# EAGLE design atsamdg21_v1.20 (EAGLE 9.5.1)
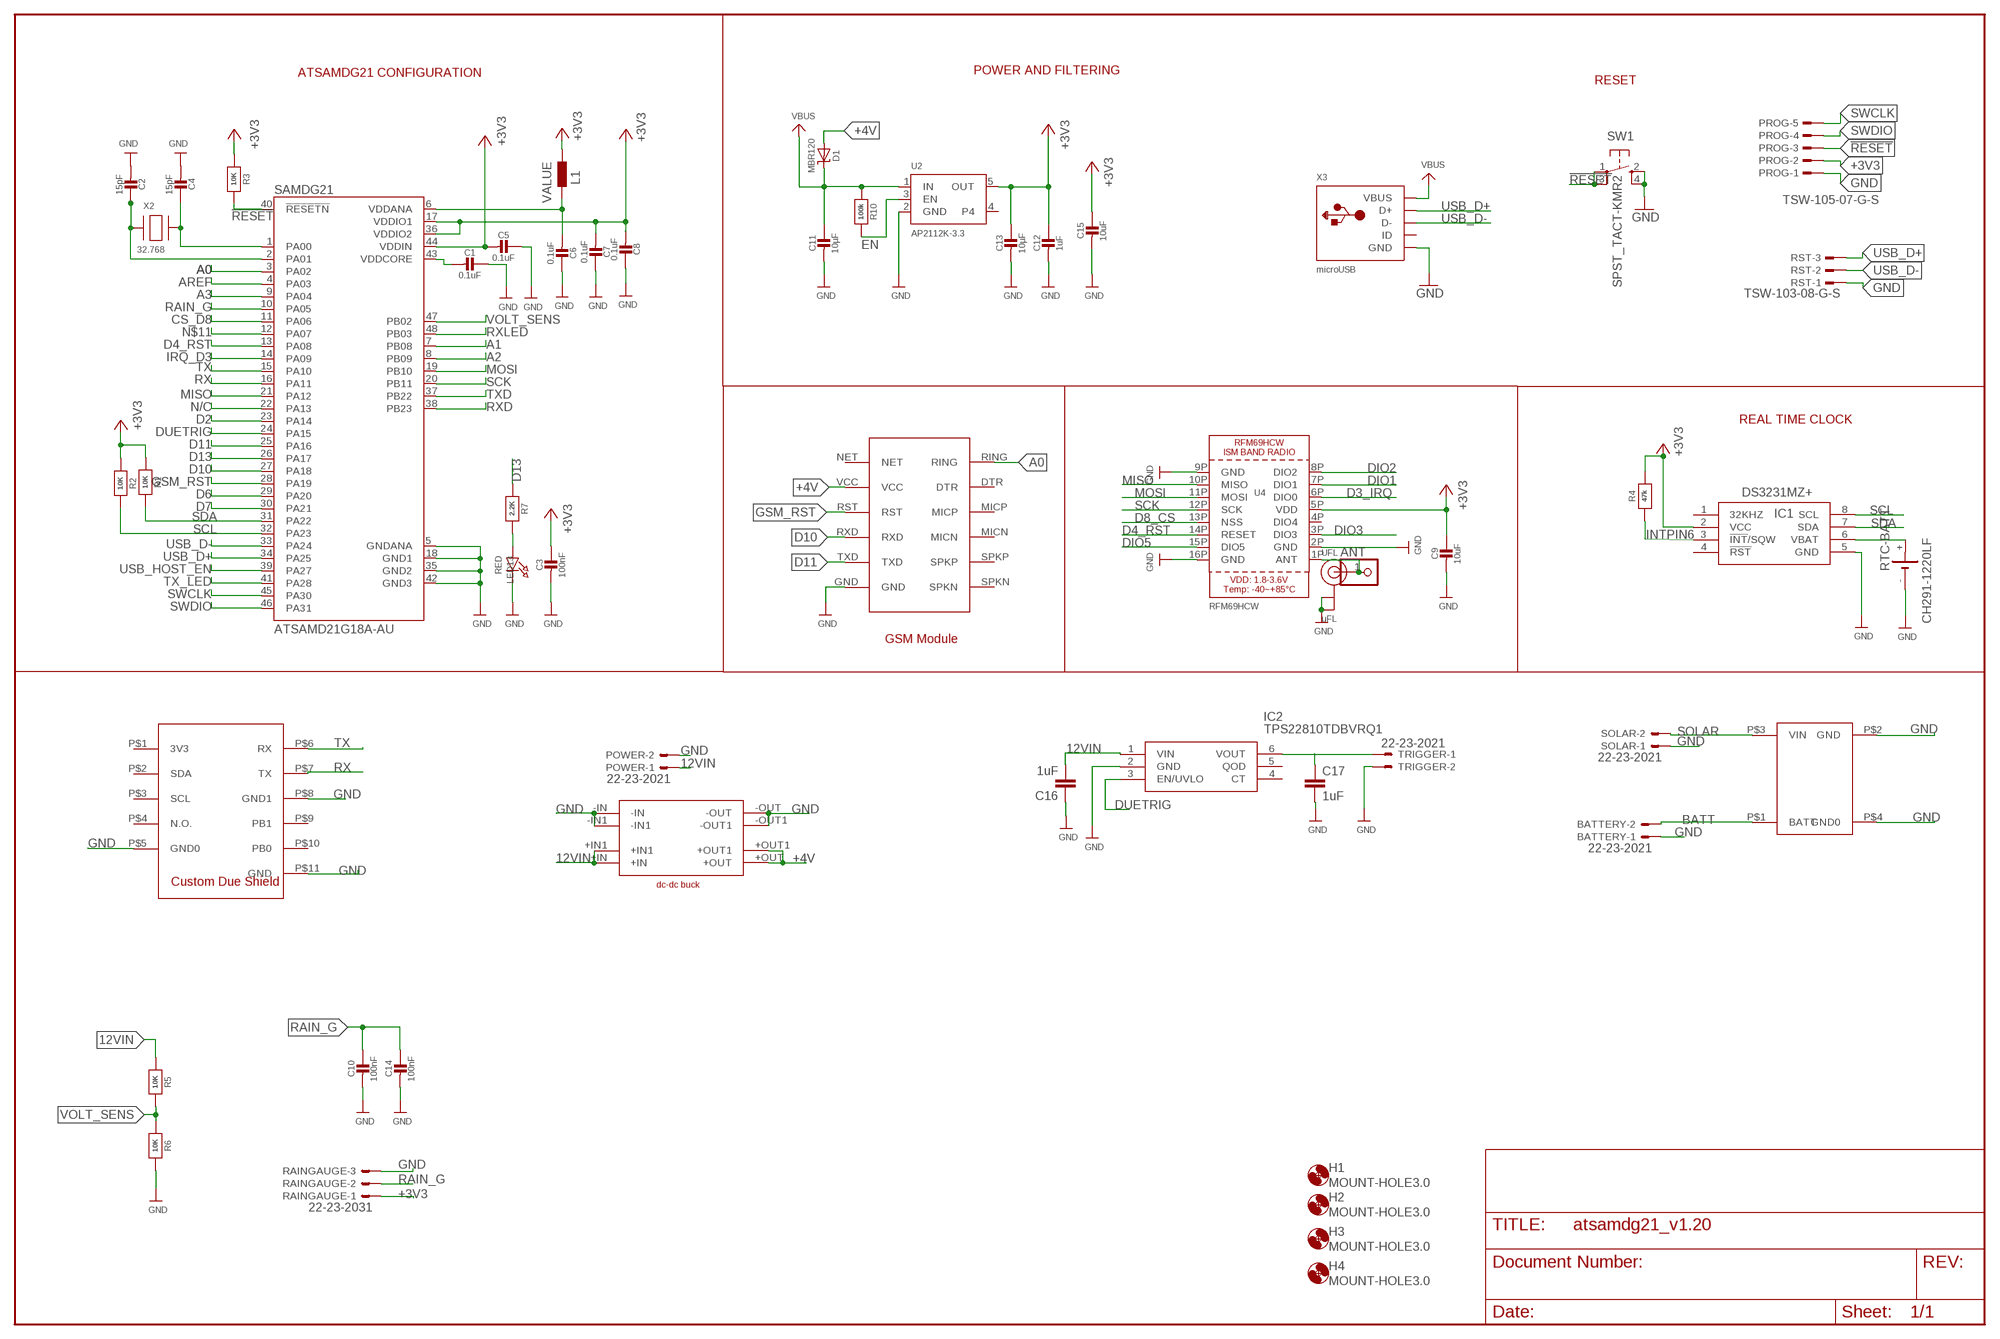
[diagram p0: schematic, sheet 1]

## Parts
ANT  HEADER-1X1ROUND  [1X01_ROUND]
BATTERY  22-23-2021  [22-23-2021]
C1  0.1uF  CAP_CERAMIC0603_NO  [0603-NO]
C2  15pF  CAP_CERAMIC0603_NO  [0603-NO]
C3  100nF  CAP_CERAMIC0603_NO  [0603-NO]
C4  15pF  CAP_CERAMIC0603_NO  [0603-NO]
C5  0.1uF  CAP_CERAMIC0603_NO  [0603-NO]
C6  0.1uF  CAP_CERAMIC0603_NO  [0603-NO]
C7  0.1uF  CAP_CERAMIC0603_NO  [0603-NO]
C8  0.1uF  CAP_CERAMIC0603_NO  [0603-NO]
C9  10uF  CAP_CERAMIC0805-NOOUTLINE  [0805-NO]
C10  100nF  CAP_CERAMIC0603_NO  [0603-NO]
C11  10µF  CAP_CERAMIC0805-NOOUTLINE  [0805-NO]
C12  1uF  CAP_CERAMIC0603_NO  [0603-NO]
C13  10µF  CAP_CERAMIC0805-NOOUTLINE  [0805-NO]
C14  100nF  CAP_CERAMIC0603_NO  [0603-NO]
C15  10uF  CAP_CERAMIC0805-NOOUTLINE  [0805-NO]
C16  1uF  CC0603  [C0603]
C17  1uF  CC0603  [C0603]
D1  MBR120  DIODE-SCHOTTKYSOD-123  [SOD-123]
H1  MOUNT-HOLE3.0  [3,0]
H2  MOUNT-HOLE3.0  [3,0]
H3  MOUNT-HOLE3.0  [3,0]
H4  MOUNT-HOLE3.0  [3,0]
IC1  DS3231MZ+  [SOIC127P600X175-8N]
IC2  TPS22810TDBVRQ1  [SOT95P280X145-6N]
L1  BLM15HB121SN1  [0402]
LED13  RED  LED0805_NOOUTLINE  [CHIPLED_0805_NOOUTLINE]
POWER  22-23-2021  [22-23-2021]
PROG  TSW-105-07-G-S  [TSW-105-XX-G-S]
R1  10K  RESISTOR_0603_NOOUT  [0603-NO]
R2  10K  RESISTOR_0603_NOOUT  [0603-NO]
R3  10K  RESISTOR_0603_NOOUT  [0603-NO]
R4  47k  RESISTOR_0603_NOOUT  [0603-NO]
R5  10K  RESISTOR_0603_NOOUT  [0603-NO]
R6  10K  RESISTOR_0603_NOOUT  [0603-NO]
R7  2.2K  RESISTOR_0603_NOOUT  [0603-NO]
R10  100k  RESISTOR_0603_NOOUT  [0603-NO]
RAINGAUGE  22-23-2031  [22-23-2031]
RST  TSW-103-08-G-S  [TSW-103-XX-G-S]
RTC-BATT  CH291-1220LF  [CH291-1220LF]
SAMDG21  ATSAMD21G18A-AU  [QFP50P900X900X120-48N]
SOLAR  22-23-2021  [22-23-2021]
SW1  SPST_TACT-KMR2  [KMR2]
TRIGGER  22-23-2021  [22-23-2021]
U2  AP2112K-3.3  VREG_SOT23-5  [SOT23-5]
U4  RFM69HCW  RFM69HCW_SMT  [RFMHCW_SMT]
U$7  SIM800L_MODULE  [SIM800L]
U$19  DC-DC_BUCK_MAD  [DC-DC_BUCK]
U$20  DUE_PADSDUE_GSM  [DUESHIELD_BIG]
U$36  LI-ION-CHARGER  [LI-ION]
UFL  uFL  ANTENNA_U.FL  [U.FL]
X2  32.768  XTAL-3.2X1.5  [XTAL3215]
X3  microUSB  USB_MICRO_20329_V2  [4UCONN_20329_V2]

## Nets
12VIN: C16.2 IC2.1(VIN) POWER.1 R5.1 U$19.+IN U$19.+IN1
!RESET: PROG.3 R3.2 SAMDG21.40(!RESETN) SW1.1(P) SW1.3(P1)
+3V3: C3.1 C5.2 C7.2 C8.2 C9.1 C12.1 C13.1 C15.1 IC1.2(VCC) L1.1 PROG.2 R1.1 R2.1 R3.1 R4.2 RAINGAUGE.1 SAMDG21.17(VDDIO1) SAMDG21.36(VDDIO2) SAMDG21.44(VDDIN) U2.5(OUT) U4.5P(VDD)
+4V: D1.A U$7.VCC U$19.+OUT U$19.+OUT1
A0: SAMDG21.3(PA02) U$7.RING
A1: SAMDG21.7(PB08)
A2: SAMDG21.8(PB09)
A3: SAMDG21.9(PA04)
ANT: ANT.1 U4.1P(ANT) UFL.3(SIGNAL)
AREF: SAMDG21.4(PA03)
BATT: BATTERY.2 U$36.P$1(BATT)
CS_D8: SAMDG21.11(PA06)
D2: SAMDG21.23(PA14)
D3_IRQ: U4.6P(DIO0)
D4_RST: SAMDG21.13(PA08) U4.14P(RESET)
D6: SAMDG21.29(PA20)
D7: SAMDG21.30(PA21)
D8_CS: U4.13P(NSS)
D10: SAMDG21.27(PA18) U$7.RXD
D11: SAMDG21.25(PA16) U$7.TXD
D13: R7.1 SAMDG21.26(PA17)
DIO1: U4.7P(DIO1)
DIO2: U4.8P(DIO2)
DIO3: U4.3P(DIO3)
DIO5: U4.15P(DIO5)
DUETRIG: IC2.3(EN/UVLO) SAMDG21.24(PA15)
EN: R10.2 U2.3(EN)
GND: BATTERY.1 C1.1 C2.2 C3.2 C4.2 C5.1 C6.1 C7.1 C8.1 C9.2 C10.2 C11.2 C12.2 C13.2 C14.2 C15.2 C16.1 C17.2 IC1.5(GND) IC2.2(GND) LED13.C POWER.2 PROG.1 R6.2 RAINGAUGE.3 RST.1 RTC-BATT.- SAMDG21.5(GNDANA) SAMDG21.18(GND1) SAMDG21.35(GND2) SAMDG21.42(GND3) SOLAR.1 SW1.2(S) SW1.4(S1) TRIGGER.2 U2.2(GND) U4.2P(GND) U4.9P(GND) U4.16P(GND) U$7.GND U$19.-IN U$19.-IN1 U$19.-OUT U$19.-OUT1 U$20.P$5(GND0) U$20.P$8(GND1) U$20.P$11(GND) U$36.P$2(GND) U$36.P$4(GND0) UFL.1(GND) UFL.2(GND) X3.BASE@1(GND) X3.BASE@2(GND) X3.GND X3.SPRT@1(GND) X3.SPRT@2(GND) X3.SPRT@3(GND) X3.SPRT@4(GND)
GSM_RST: SAMDG21.28(PA19) U$7.RST
INTPIN6: IC1.3(!INT!/SQW) R4.1
IRQ_D3: SAMDG21.14(PA09)
MISO: SAMDG21.21(PA12) U4.10P(MISO)
MOSI: SAMDG21.19(PB10) U4.11P(MOSI)
N$1: C1.2 SAMDG21.43(VDDCORE)
N$2: IC1.6(VBAT) RTC-BATT.+
N$4: C6.2 L1.2 SAMDG21.6(VDDANA)
N$5: C2.1 SAMDG21.2(PA01) X2.P$1
N$6: C17.1 IC2.6(VOUT) TRIGGER.1
N$7: C4.1 SAMDG21.1(PA00) X2.P$2
N$11: SAMDG21.12(PA07)
N$40: LED13.A R7.2
N/C: SAMDG21.22(PA13)
RAIN_G: C10.1 C14.1 RAINGAUGE.2 SAMDG21.10(PA05)
RX: SAMDG21.16(PA11) U$20.P$7(TX)
RXD: SAMDG21.38(PB23)
RXLED: SAMDG21.48(PB03)
SCK: SAMDG21.20(PB11) U4.12P(SCK)
SCL: IC1.8(SCL) R2.2 SAMDG21.32(PA23)
SDA: IC1.7(SDA) R1.2 SAMDG21.31(PA22)
SOLAR: SOLAR.2 U$36.P$3(VIN)
SWCLK: PROG.5 SAMDG21.45(PA30)
SWDIO: PROG.4 SAMDG21.46(PA31)
TX: SAMDG21.15(PA10) U$20.P$6(RX)
TX_LED: SAMDG21.41(PA28)
TXD: SAMDG21.37(PB22)
USB_D+: RST.3 SAMDG21.34(PA25) X3.D+
USB_D-: RST.2 SAMDG21.33(PA24) X3.D-
USB_HOST_EN: SAMDG21.39(PA27)
VBUS: C11.1 D1.C R10.1 U2.1(IN) X3.VBUS
VOLT_SENS: R5.2 R6.1 SAMDG21.47(PB02)
Unconnected: IC1.1(32KHZ) IC1.4(!RST) IC2.4(CT) IC2.5(QOD) U2.4 U4.4P(DIO4) U$7.DTR U$7.MICN U$7.MICP U$7.NET U$7.SPKN U$7.SPKP U$20.P$1(3V3) U$20.P$2(SDA) U$20.P$3(SCL) U$20.P$4(N.O.) U$20.P$9(PB1) U$20.P$10(PB0) X3.ID

## Notes on the sheet
- ATSAMDG21 CONFIGURATION | POWER AND FILTERING
- RESET
- REAL TIME CLOCK
- GSM Module

## Library data of the parts
ANT = microbuilder:HEADER-1X1: PIN HEADER
BATTERY POWER SOLAR TRIGGER = con-molex:22-23-2021: .100" (2.54mm) Center Header - 2 Pin; MF: MOLEX; MPN: 22-23-2021; OC_FARNELL: 1462926; OC_NEWARK: 25C3832
C1-C15 = microbuilder:CAP_CERAMIC: Ceramic Capacitors For new designs, use the packages preceded by an '_' character since they are more reliable: The following footprints should be used on most boards: _0402 - Standard footprint for regular board layouts _0603 - Standard footprint for regular board layouts _0805 - Standard footprint for regular board layouts _1206 - Standard footprint for regular board layouts For extremely tight-pitch boards where space is at a premium, the following 'micro-pitch' footprints can be used (smaller pads, no silkscreen outline, etc.): _0402MP - Micro-pitch footprint for very dense/compact boards _0603MP - Micro-pitch footprint for very dense/compact boards _0805MP - Micro-pitch footprint for very dense/compact boards _1206MP - Micro-pitch footprint for very dense/compact boards
C16 C17 = eagle-ltspice:C: CAPACITOR, European symbol; SPICEMODEL: NONE; SPICEPREFIX: C
D1 = microbuilder:DIODE-SCHOTTKY
H1-H4 = holes:MOUNT-HOLE: MOUNTING HOLE with drill center marker
IC1 = DS3231MZ+:DS3231MZ+: Real Time Clock 5+/-ppm RTC Source: Datasheet <http://uk.rs-online.com/web/p/products/1897249>; DESCRIPTION: Real Time Clock 5+/-ppm RTC; HEIGHT: 1.75mm; MANUFACTURER_NAME: Maxim Integrated; MANUFACTURER_PART_NUMBER: DS3231MZ+; RS_PART_NUMBER: 1897249; RS_PRICE-STOCK: http://uk.rs-online.com/web/p/products/1897249
IC2 = TPS22810TDBVRQ1:TPS22810TDBVRQ1: Automotive 18V, 2A, 79m Load Switch With Adjustable Rise Time and Adjustable Quick Output Discharge Source: Datasheet <http://www.ti.com/lit/gpn/tps22810-q1>; DESCRIPTION: Automotive 18V, 2A, 79m Load Switch With Adjustable Rise Time and Adjustable Quick Output Discharge; HEIGHT: 1.45mm; MANUFACTURER_NAME: Texas Instruments; MANUFACTURER_PART_NUMBER: TPS22810TDBVRQ1
L1 = inductors:BLM15H: EMIFIL (R) Chip Ferrite Bead for GHz Noise Source: http://www.murata.com/ Ferrite Bead BLM15H.pdf
LED13 = microbuilder:LED: LED 0603 - 0603 Surface Mount Package 2mA: Green LED - Low Power (3.9mcd, 2ma, 1.7Vf) - Digikey: 475-2709-2-ND Orange LED - Low Power (9.8mcd, 2ma, 1.8Vf) - Digikey: 475-1194-2-ND Red LED - Low Power (5mcd, 2ma, 1.8Vf) - Digikey: 475-1195-2-ND Yellow LED - Low Power (7mcd, 2ma, 1.8Vf) - Digikey: 475-1196-2-ND 5mA: Blue LED - Low Power (17mcd, 5ma, 2.9Vf) - Digikey: LNJ937W8CRACT-ND 0805 - 0805 Surface Mount Package 2mA: Red LED (8.8mcd, 2mA, 1.8Vf, Clear) - Low Power [Digikey: 475-2510-1-ND] Green LED (5mcd, 2mA, 1.8Vf, Clear) - Low Power [Digikey: 475-2730-1-ND] Yellow LED (11.3mcd, 2mA, 1.8Vf, Clear) - Low Power [Digikey: 475-2555-1-ND] 20mA: Red LED (104mcd, 20mA, Diffused) - LS R976 [Digikey: 475-1278-6-ND] Red LED (12mcd, 20mA, 2.0Vf, Clear) - APT2012EC [Digikey: 754-1128-1-ND] Green LED (15mcd, 20mA, 2.2Vf, Clear) - APT2012GC [Digikey: 754-1131-1-ND] Orange LED (160mcd, 20mA, 2.1Vf, Clear) - APT2012SECK [Digikey: 754-1130-1-ND] 1206 - 1206 Surface Mount Package Green LED (26mcd, 20mA, Diffused) - LG N971 [Digikey: 475-1407-6-ND] Red LED (15mcd, 20mA, Diffused) - LH N974 [Digikey: 475-1416-6-ND] Cree - Cree High-Power Surface Mount LEDs XPEBWT-L1-0000-00D50 - White 111lm 350mA 2.9Vf 6200K 110° XTEAWT-00-0000-00000LEE3 - White 114lm 350mA 2.85Vf 5000K 115° Everlight - Everlight 45-21 Series Surface Mount LEDs 45-21/QK2C-B2832AC2CB2/2T - Warm White 2000mcd 20mA 3.25Vf 3050K 120° 45-21/LK2C-B38452C4CB2/2T - Nuetral White 2000mcd 20mA 3.25Vf 4150K 120° 45-21/LK2C-B50634C6CB2/2T - Cold White 2200mcd 20mA 3.25Vf 5650K 120° PLCC2 Reverse Mount LS T77K-J1L2-1-0-2-R18-Z - Red 11.25mcd 2mA 1.8Vf 630nm 120° LO T77K-L1M2-24-Z - Orange 19.6mcd 2mA 1.8Vf 606nm 120° LY T77K-K2M1-26-Z - Yellow 15.7mcd 2mA 1.8Vf 587nm 120°
PROG = con-samtec:TSW-105-*-G-S: THROUGH-HOLE .025" SQ POST HEADER Source: Samtec TSW.pdf; MF: Samtec Inc.; MPN: TSW-105-07-G-S
R1-R7 R10 = microbuilder:RESISTOR: Resistors For new designs, use the packages preceded by an '_' character since they are more reliable: The following footprints should be used on most boards: _0402 - Standard footprint for regular board layouts _0603 - Standard footprint for regular board layouts _0805 - Standard footprint for regular board layouts _1206 - Standard footprint for regular board layouts For extremely tight-pitch boards where space is at a premium, the following 'micro-pitch' footprints can be used (smaller pads, no silkscreen outline, etc.): _0402MP - Micro-pitch footprint for very dense/compact boards _0603MP - Micro-pitch footprint for very dense/compact boards _0805MP - Micro-pitch footprint for very dense/compact boards _1206MP - Micro-pitch footprint for very dense/compact boards
RAINGAUGE = con-molex:22-23-2031: .100" (2.54mm) Center Header - 3 Pin; MF: MOLEX; MPN: 22-23-2031; OC_FARNELL: 1462950; OC_NEWARK: 30C0862
RST = con-samtec:TSW-103-*-G-S: THROUGH-HOLE .025" SQ POST HEADER Source: Samtec TSW.pdf; MF: Samtec Inc.; MPN: TSW-103-07-G-S
RTC-BATT = battery:CH291-1220LF: Battery Holder, SMT, 12mm multicomp PART NO. CH291-1220LF Source: Data sheet <http://www.farnell.com/datasheets/1505860.pdf>
SAMDG21 = ATSAMD21G18A-AU:ATSAMD21G18A-AU: Cortex-M0+, 256KB FLASH, 32KB SRAM, USB, DMA, T&R - 48TQFP IND TEMP, GREEN, 1.6-3.6V, 48MHz; AVAILABILITY: Unavailable; DESCRIPTION: SAMD21G Series 256 kB Flash 32 kB SRAM 48 MHz 32-Bit Microcontroller - TQFP-48; MF: Microchip; MP: ATSAMD21G18A-AU; PACKAGE: TQFP-48 Microchip; PRICE: None
SW1 = adafruit:SPST_TACT: SMT 6mm switch, EVQQ2 series http://www.ladyada.net/library/eagle
U2 = microbuilder:VREG_SOT23-5: SOT23-5 Fixed Voltage Regulators Part Current Out V Out V In V Dropout θJA (°C/W) TJ (°C) Digikey Part No. ADP121 150mA 3.3V 3.4-5.5V 0.09V @ 150mA -- -- ADP121-AUJZ33R7CT-ND ADP121 150mA 3.0V 3.1-5.5V 0.09V @ 150mA -- -- ADP121-AUJZ30R7CT-ND ADP122 300mA 3.3V 3.4-5.5V 0.085V @ 300mA -- -- ADP122AUJZ-3.3-R7CT-ND ADP1712 300mA 3.3V 3.5-5.5V 0.17V @ 300mA -- -- ADP1712AUJZ-3.3-R7TR-ND AP7311 (Low Cost) 150mA 3.3V 3.5-6V 0.15V @ 150mA -- -- AP7311-33WG-7DICT-ND LD39015M18R 150mA 1.8V 1.9V-5.5V 0.08V @ 100mA -- -- 497-6977-1-ND LP2985A-33DBVR 150mA 3.3V 3.3-16V 0.28V @ 150mA 206 150 296-18479-1-ND MCP1824T-3302E/OT 300mA 3.3V 3.5V-6V 0.2V @ 300mA -- -- MCP1824T-3302E/OTCT-ND MIC5205-2.5YM5 TR 150mA 2.5V 2.7-16V 0.165V @ 150mA -- -- 576-1257-2-ND MIC5205-3.0YM5 TR 150mA 3.0V 3.2V-16V 0.165V @ 150mA -- -- 576-1258-2-ND MIC5205-3.3YM5 TR 150mA 3.3V 3.5V-16V 0.165V @ 150mA -- -- 576-1259-2-ND TPS780330220 150mA 3.3V+2.2V 3.6-5.5V 250mV Max -- -- 296-23332-1-ND TDA3663/N1,135 100mA 3.3V 3.5-45V 0.18V @ 50mA -- -- 568-5343-1-ND Max operating temp can be calculated using θJA, TJ (max junction temperature), and power in watts. Set the "Maximum Ambient Temperature" until it reaches TJ ("Max Junction Temperature"), which is the absolute limit for safe use of the regulator: Heat Sink Temperature Calculator <http://www.daycounter.com/Calculators/Heat-Sink-Temperature-Calculator.phtml> For example, With 12V source into a 3.3V LP2985 and a 30mA load, we are dissipating (12V-3.3V) * 0.03A = 0.261W. With a θJA of 206 °C/W, a TJ of 150°C, and 261mW we can safely use the chip without a heat sink up to 75°C (=147.1°C Junction Temperature).
U4 = microbuilder:RFM69HCW: RFM69HCW - ISM Band RF Transceiver
U$7 = sim800L_module:SIM800L_MODULE
U$19 = dc-dc_mad:DC-DC_BUCK_MAD
U$20 = due_shield_pad:DUE_PADS
U$36 = LI-ION-CHARGER:LI-ION-CHARGER
UFL = microbuilder:ANTENNA_U.FL: U.FL Antenna Connector
X2 = adafruit2:XTAL: Low cost SMT crystals, no capacitors included http://www.ladyada.net/library/eagle
X3 = microbuilder:USB: USB Connectors USBMINIB - Surface Mount Female Mini-B USB Connector 4UConnector: 06564

## Board
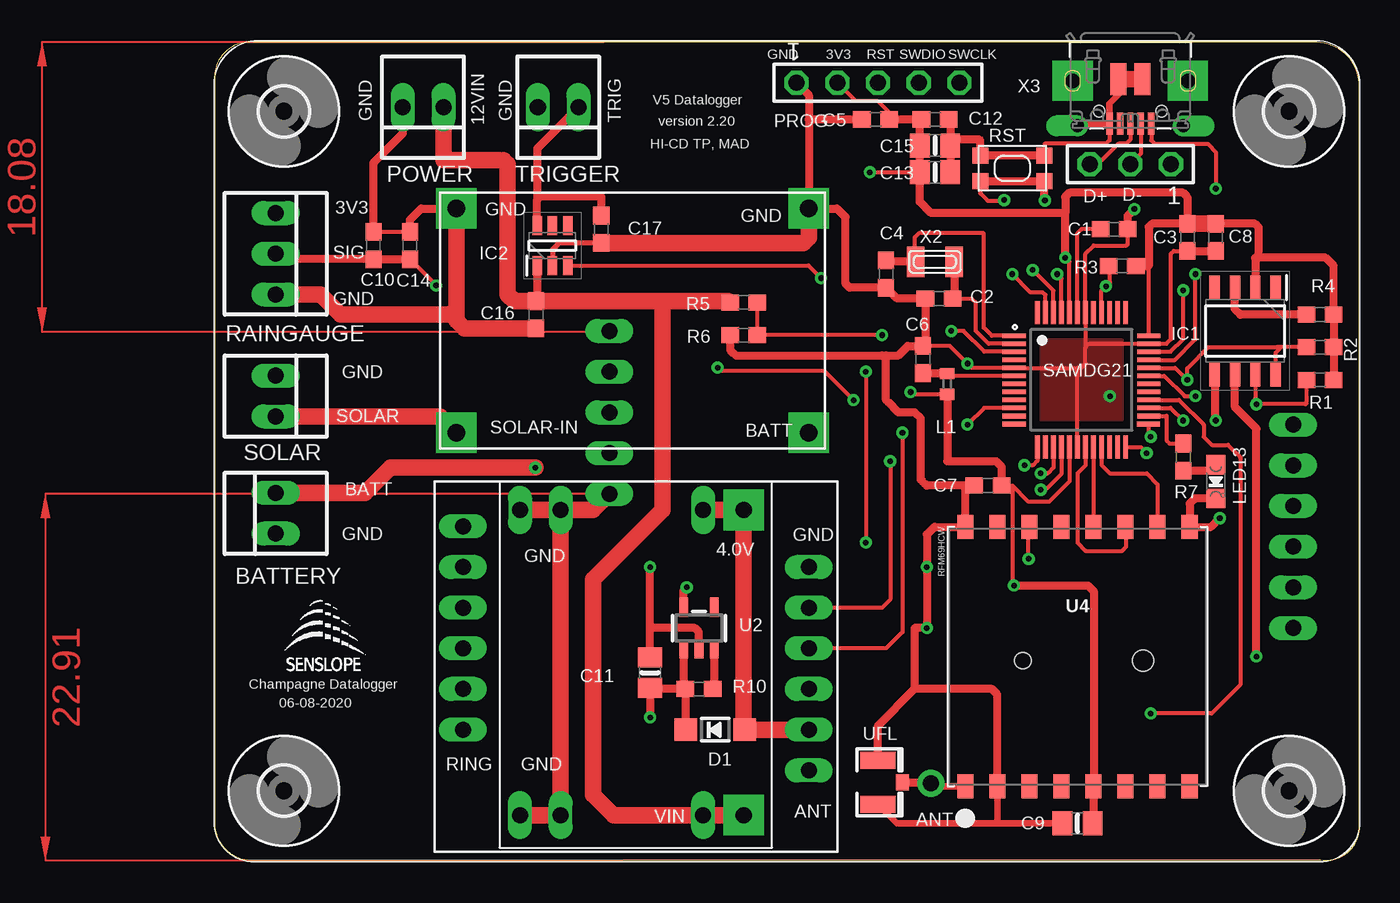
[diagram p1: board, top side]
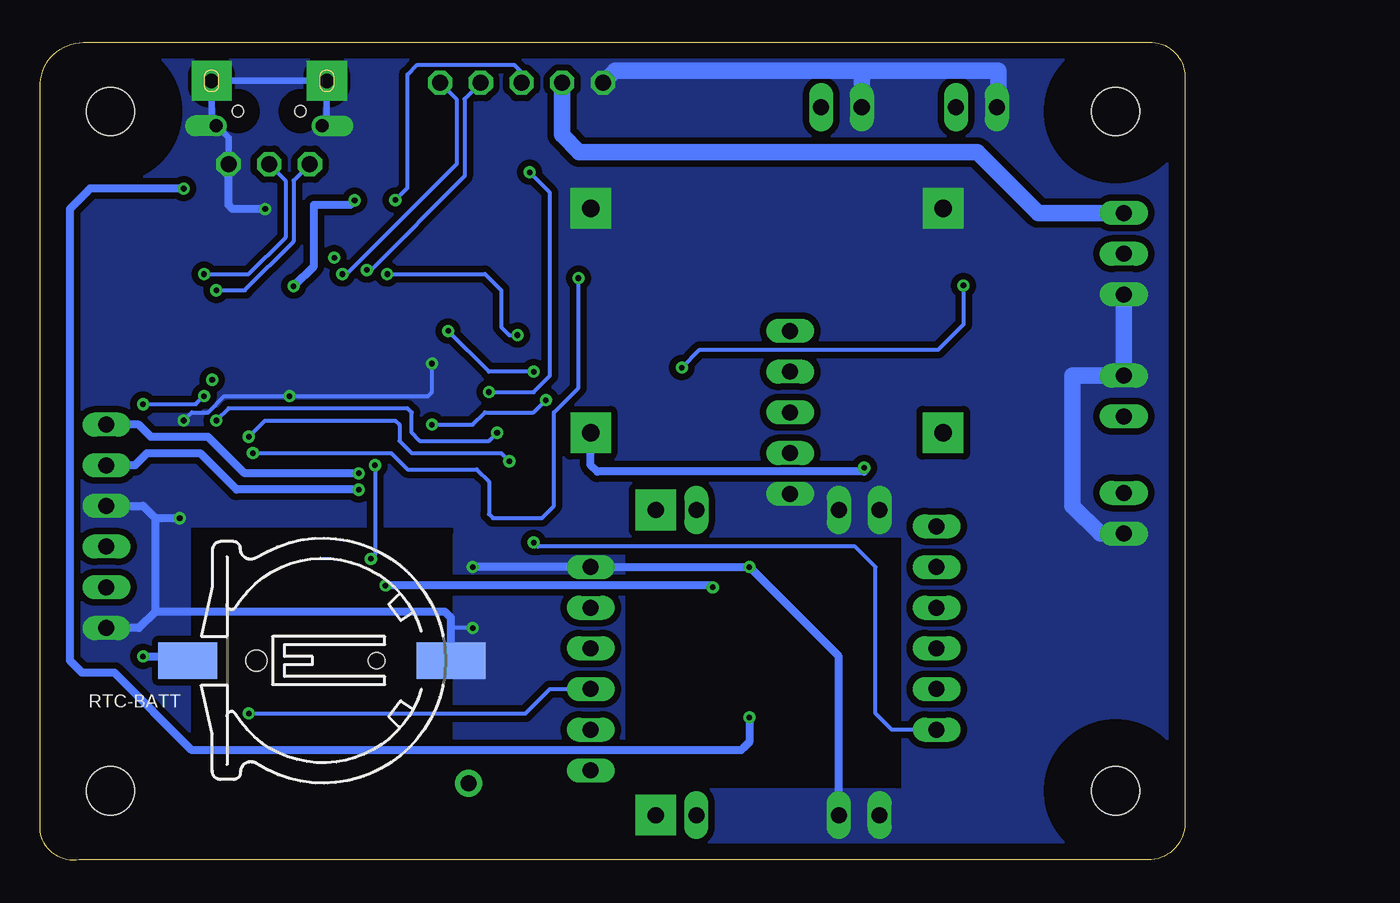
[diagram p2: board, bottom side, seen from below]

Size 71.45 x 51.07 mm. Coordinates in mm from the lower left corner, seen from the top.
Outline: 71.45,1.8 71.45,48.27 arc90 68.76,51.07 2.03,51.07 arc90 0,48.78 0,2.31 arc90 2.29,0.02 69.01,0.02 arc90 71.45,1.8
Copper layers (1*16): Top 0.035mm / dielectric 1.5mm / Bottom 0.035mm
Design rules "default": minimum track width 6mil, minimum drill 0.35mm, track to track 6mil, track to pad 6mil, pad to pad 6mil, via to via 6mil, smd to smd 6mil, copper to edge 40mil, drill to drill 6mil, minimum pad ring 10mil, minimum via ring 8mil, stop-mask expansion 4mil, vias tented up to drill 0mil, thermal gap 10mil

### Footprints (pad centres in the part's own frame; a part is rotated, then mirrored left to right if it is on the bottom)
1X01_ROUND = drill 1 pad 1.676: 1 0,0
22-23-2021 = drill 1 long: 1 -1.27,0; 2 1.27,0
0603-NO = smd 1.1 x 1: 1 -0.85,0; 2 0.85,0
0805-NO = smd 1.24 x 1.5: 1 -0.95,0; 2 0.95,0
C0603 = smd 1.1 x 1: 1 -0.85,0; 2 0.85,0
SOD-123 = smd 1.4 x 1.4: A 1.85,0; C -1.85,0
3,0 = hole 3: 0,0
SOIC127P600X175-8N = smd 1.525 x 0.65: 1 -2.712,1.905; 2 -2.712,0.635; 3 -2.712,-0.635; 4 -2.712,-1.905; 5 2.712,-1.905; 6 2.712,-0.635; 7 2.712,0.635; 8 2.712,1.905
SOT95P280X145-6N = smd 1.2 x 0.6: 1 -1.25,0.95; 2 -1.25,0; 3 -1.25,-0.95; 4 1.25,-0.95; 5 1.25,0; 6 1.25,0.95
0402 = smd 0.7 x 0.9: 1 -0.65,0; 2 0.65,0
CHIPLED_0805_NOOUTLINE = smd 1.2 x 1.2: A 0,-1.05; C 0,1.05
TSW-105-XX-G-S = drill 1 pad 1.5 octagon: 1 5.08,0; 2 2.54,0; 3 0,0; 4 -2.54,0; 5 -5.08,0
22-23-2031 = drill 1 long: 1 -2.54,0; 2 0,0; 3 2.54,0
TSW-103-XX-G-S = drill 1 pad 1.5 octagon: 1 2.54,0; 2 0,0; 3 -2.54,0
CH291-1220LF = smd 2.3 x 3.66: + 0,-2.296 | smd 2.3 x 4.3: - 0,14.146 | hole 1.3: 0,2 | hole 1: 0,9.5
QFP50P900X900X120-48N = smd 1.45 x 0.3: 1 -4.2,2.75; 2 -4.2,2.25; 3 -4.2,1.75; 4 -4.2,1.25; 5 -4.2,0.75; 6 -4.2,0.25; 7 -4.2,-0.25; 8 -4.2,-0.75; 9 -4.2,-1.25; 10 -4.2,-1.75; 11 -4.2,-2.25; 12 -4.2,-2.75; 25 4.17,-2.75; 26 4.2,-2.25; 27 4.2,-1.75; 28 4.2,-1.25; 29 4.2,-0.75; 30 4.2,-0.25; 31 4.2,0.25; 32 4.2,0.75; 33 4.2,1.25; 34 4.2,1.75; 35 4.2,2.25; 36 4.2,2.75 | smd 0.3 x 1.45: 13 -2.75,-4.2; 14 -2.25,-4.2; 15 -1.75,-4.2; 16 -1.25,-4.2; 17 -0.75,-4.2; 18 -0.25,-4.2; 19 0.25,-4.2; 20 0.75,-4.2; 21 1.25,-4.2; 22 1.75,-4.2; 23 2.25,-4.2; 24 2.75,-4.2; 37 2.75,4.2; 38 2.25,4.2; 39 1.75,4.2; 40 1.25,4.2; 41 0.75,4.2; 42 0.25,4.2; 43 -0.25,4.2; 44 -0.75,4.2; 45 -1.25,4.2; 46 -1.75,4.2; 47 -2.25,4.2; 48 -2.75,4.2
KMR2 = smd 1 x 1: 1 2,0.8; 2 2,-0.8; 3 -2,0.8; 4 -2,-0.8
SOT23-5 = smd 0.55 x 1.2: 1 -0.95,-1.3; 2 0,-1.3; 3 0.95,-1.3; 4 0.95,1.3; 5 -0.95,1.3
RFMHCW_SMT = smd 1.5 x 1: 1P 8.1,-7; 2P 8.1,-5; 3P 8.1,-3; 4P 8.1,-1; 5P 8.1,1; 6P 8.1,3; 7P 8.1,5; 8P 8.1,7; 9P -8.1,7; 10P -8.1,5; 11P -8.1,3; 12P -8.1,1; 13P -8.1,-1; 14P -8.1,-3; 15P -8.1,-5; 16P -8.1,-7
SIM800L = drill 1 long: DTR 11.176,1.27; GND -10.414,-6.35; MICN 11.176,-3.81; MICP 11.176,-1.27; NET -10.414,6.35; RING 11.176,3.81; RST -10.414,1.27; RXD -10.414,-1.27; SPKN 11.176,-8.89; SPKP 11.176,-6.35; TXD -10.414,-3.81; VCC -10.414,3.81
DC-DC_BUCK = drill 1 pad 2.54 square: +IN 7.112,-8.89; +OUT 7.112,10.16 | drill 1 long: +IN1 4.572,-8.89; +OUT1 4.572,10.16; -IN -6.858,-8.89; -IN1 -4.318,-8.89; -OUT -6.858,10.16; -OUT1 -4.318,10.16
DUESHIELD_BIG = drill 1 long: P$1 -21.082,8.89; P$2 -21.082,6.35; P$3 -21.082,3.81; P$4 -21.082,1.27; P$5 -21.082,-1.27; P$6 21.59,3.048; P$7 21.59,0.508; P$8 21.59,-2.032; P$9 21.59,-4.572; P$10 21.59,-7.112; P$11 21.59,-9.652
LI-ION = drill 1.1 pad 2.54 square: P$1 0,0; P$2 14,0; P$3 0,22; P$4 14,22
U.FL = smd 2.2 x 1.05: 1 0,1.375; 2 0,-1.375 | smd 0.8 x 1: 3 1.525,0
XTAL3215 = smd 1.1 x 1.9: P$1 1.2,0; P$2 -1.2,0
4UCONN_20329_V2 = smd 1 x 2: BASE@1 -0.75,-2; BASE@2 0.75,-2 | smd 0.4 x 1.35: D+ 0,0.775; D- -0.65,0.775; GND 1.3,0.775; ID 0.65,0.775; VBUS -1.3,0.775 | drill 0.8 pad 1.2 offset: SPRT@1 -3.3,0.9; SPRT@2 3.3,0.9 | drill 0.9 pad 2.5 square: SPRT@3 -3.6,-1.9; SPRT@4 3.6,-1.9 | hole 0.7: -1.95,0; 1.95,0

### Placement (x,y rotation side)
ANT  44.71,4.8 0 top
BATTERY  3.81,21.67 90 top
C1  56.14,39.39 180 top
C2  45.21,35.08 180 top
C3  60.71,38.89 270 top
C4  41.91,36.6 270 top
C5  41.25,46.25 0 top
C6  44.2,31.27 270 top
C7  48.26,23.39 0 top
C8  62.49,38.89 90 top
C9  53.85,2.31 180 top
C10  9.91,38.38 90 top
C11  27.18,11.71 90 top
C12  44.96,46.25 0 top
C13  44.96,42.95 0 top
C14  12.19,38.38 90 top
C15  44.96,44.63 0 top
C16  20.07,34.06 90 top
C17  24.13,39.39 270 top
D1  31.24,8.15 0 top
H1  4.32,46.76 0 top
H2  67.06,46.76 0 top
H3  4.32,4.34 0 top
H4  67.06,4.34 0 top
IC1  64.32,33.04 270 top
IC2  21.08,38.38 90 top
L1  45.72,29.74 90 top
LED13  62.49,23.65 180 top
POWER  13.01,47.01 180 top
PROG  41.4,48.54 180 top
R1  68.99,30 180 top
R2  68.99,32.03 180 top
R3  56.64,37.11 180 top
R4  68.99,34.06 0 top
R5  33.02,34.82 0 top
R6  33.02,32.79 180 top
R7  60.45,25.17 270 top
R10  30.23,10.69 0 top
RAINGAUGE  3.81,37.87 270 top
RST  57.15,43.46 0 top
RTC-BATT  59.95,12.47 270 bottom
SAMDG21  54.1,30 0 top
SOLAR  3.81,28.98 270 top
SW1  49.79,43.2 180 top
TRIGGER  21.44,47.01 180 top
U2  30.23,14.5 0 top
U4  53.85,12.72 270 top
U$7  26.67,11.96 180 top
U$19  25.91,11.71 0 top
U$20  45.72,24.15 0 top
U$24  [LOGO_SML_TNAME]  6.68,13.45 0 top
U$36  37.09,26.69 90 top
UFL  41.4,4.88 0 top
X2  44.96,37.36 0 top
X3  57.15,46.76 180 top

### Tracks (layer width: path | path; a pad name or v marks a point on that pad's centre or on a via)
12VIN
  Top 0.508: 17.78,43.71 18.04,43.71 | IC2.1 20.13,34.98 C16.2
  Top 1.016: U$19.+IN U$19.+IN1 24.89,2.82 23.62,4.09 23.62,17.55 27.94,21.87 27.94,34.91 | 27.94,34.91 C16.2 18.71,34.91 18.29,35.33 18.29,43.46 18.04,43.71 | 27.94,34.91 32.08,34.91 R5.1 | POWER.1 14.28,43.71 17.78,43.71
!RESET  (via drill 0.35)
  Top 0.254: SAMDG21.40 55.35,35.56 v55.63,35.84 55.88,36.09 55.88,37.02 R3.2 | SW1.1 47.79,41.65 48.26,41.17 49.28,41.17 v49.28,41.22
  Top 0.508: v51.82,41.2 51.79,41.23 SW1.3 SW1.1
  Bottom 0.254: v49.28,41.22 48.52,41.99 48.52,49.05 47.91,49.66 41.86,49.66 41.4,49.2 PROG.3
  Bottom 0.508: v55.63,35.84 54.36,37.11 54.36,40.92 52.1,40.92 v51.82,41.2
+3V3  (via drill 0.35)
  Top 0.254: SAMDG21.17 53.35,23.66 52.07,22.38 50.8,22.38 49.79,23.39 | C7.2 49.79,23.39 | SAMDG21.44 53.35,37.35 v53.09,37.62 | U4.5P 54.87,4.61 | SAMDG21.36 58.3,37.11 | v49.9,17.15 49.79,17.26 49.79,23.39 | L1.1 43.58,29.09 v43.44,29.23 | v40.9,42.95 C13.1 | PROG.2 39.98,47.42 41.35,47.42 42.1,46.67 C5.2
  Top 0.508: C7.2 49.11,24.57 48.77,24.92 45.72,24.92 L1.1 | R1.1 R2.1 R4.2 69.84,37.12 69.34,37.62 65.15,37.62 | C8.2 64.94,39.74 65.15,39.52 65.15,37.62 | IC1.2 64.95,37.62 65.15,37.62 | R3.1 58.3,37.11 58.3,39.53 58.51,39.74 C3.1 60.71,41.43 60.45,41.68 53.34,41.68 53.09,41.43 53.09,40.41 | 54.87,4.61 54.87,16.79 54.5,17.15 v49.9,17.15 | C5.2 C12.1 44.01,46.15 C15.1 C13.1 44.01,41.11 44.71,40.41 53.09,40.41 | v53.09,37.62 53.09,40.41 | U2.5 29.28,16.85 v29.47,17.04 | U4.5P 54.85,2.36 C9.1
  Top 1.016: C3.1 C8.2
  Bottom 0.254: v43.44,29.23 40.64,29.23 39.63,30.25 39.63,41.68 v40.9,42.95
  Bottom 0.508: v29.47,17.04 29.58,17.15 v49.9,17.15
  Bottom 1.016: RAINGAUGE.1 9.15,40.41 12.96,44.22 37.8,44.22 38.86,45.29 PROG.2
+4V
  Top 0.254: D1.A 33.28,8.15 33.02,8.41 33.02,8.66
  Top 1.016: 33.28,8.15 U$7.VCC | U$19.+OUT1 U$19.+OUT 33.02,8.66
A0  (via drill 0.35)
  Top 0.254: SAMDG21.3 48.04,31.75 46.74,33.04 v45.98,33.04 | v40.64,30.5 v40.64,19.84
  Bottom 0.254: U$7.RING 18.29,8.15 19.31,9.17 19.31,18.31 20.58,19.58 40.39,19.58 v40.64,19.84 | v40.64,30.5 43.44,30.5 v45.98,33.04
ANT
  Top 0.406: U4.1P 44.88,4.62 ANT.1
  Top 0.508: ANT.1 44.67,4.76 44.56,4.88 UFL.3
BATT  (via drill 0.35)
  Top 1.016: v20.02,24.51 10.98,24.51 9.4,22.94 BATTERY.2
  Bottom 0.508: v20.02,24.51 20.02,24.26 36.69,24.26 37.09,24.66 U$36.P$1
D4_RST  (via drill 0.35)
  Top 0.254: SAMDG21.13 51.35,24.96 51.06,24.66 v50.55,24.66 | v50.8,18.82 50.8,20.78 U4.14P
  Bottom 0.254: v50.55,24.66 50.55,19.07 v50.8,18.82
D10  (via drill 0.35)
  Top 0.254: v42.93,26.69 42.93,14.25 41.91,13.23 U$7.RXD | SAMDG21.27 59.66,28.25 v60.45,27.46
  Bottom 0.254: v42.93,26.69 43.44,26.19 47.75,26.19 48.26,26.69 48.26,27.96 48.52,28.22 59.69,28.22 v60.45,27.46
D11  (via drill 0.35)
  Top 0.254: SAMDG21.25 58.27,26.59 v58.42,26.44 | v42.17,24.92 42.17,16.28 41.66,15.77 U$7.TXD
  Bottom 0.254: v58.42,26.44 57.41,27.46 49.28,27.46 49.02,27.2 49.02,26.19 48.26,25.42 42.67,25.42 v42.17,24.92
D13
  Top 0.254: SAMDG21.26 59.4,27.75 59.4,26.22 59.6,26.02 R7.1
DC-CUT
  cutout Bottom: 17.99,4.55 34.61,4.55 arc45 34.85,4.65 34.85,20.09 17.78,20.09 17.78,4.55
DUETRIG  (via drill 0.35)
  Top 0.254: SAMDG21.24 57.8,25.8 v58.17,25.42 | IC2.3 37.07,37.13 v37.85,36.35
  Bottom 0.254: v58.17,25.42 49.53,25.42 48.52,24.41 44.2,24.41 43.44,23.65 43.44,21.61 43.18,21.36 40.13,21.36 39.37,22.12 39.37,27.96 37.85,29.49 v37.85,36.35
EN
  Top 0.254: 31.18,10.79 R10.2
  Top 0.508: U2.3 31.18,10.79
GND  (via drill 0.35)
  Top 0.254: 32.39,31.65 32.51,31.52 | 41.66,31.52 41.91,31.52 | 43.27,32.12 C6.1 44.45,32.12 45.89,32.12 v46.99,31.01 47.26,30.75 SAMDG21.5 53.85,30.75 | C14.2 C10.2 | C1.1 56.99,38.47 56.9,38.38 54.87,38.38 54.35,37.87 SAMDG21.42 54.36,32.03 | 44.33,23.52 44.2,23.65 | 42.04,28.6 41.91,28.73 | 53.85,30.75 54.09,30.75 54.36,31.01 54.36,32.03 | 54.36,32.03 54.58,32.25 SAMDG21.35 59.4,32.25 59.69,32.54 59.69,37.87 59.86,38.04 C3.2 | SAMDG21.18 53.85,30.74 53.85,30.75 | X3.GND 55.85,44.95 55.63,44.73 51.82,44.73 51.82,44.04 SW1.4
  Top 0.305: IC2.2 21.08,38.12 21.5,38.54 C17.2
  Top 0.406: X3.BASE@2 56.4,47.79 55.85,47.24 X3.GND 53.98,45.99 X3.SPRT@2 | UFL.2 42.59,2.31 48.77,2.31 | 48.77,2.31 C9.2 | U4.2P 48.85,2.39 48.77,2.31
  Top 0.508: C6.1 44.36,32.28 C2.2 42.59,35.08 C4.2 39.63,35.75 39.37,36 39.37,40.16 38.83,40.69 U$36.P$2 37.09,46.25 | C7.1 46.99,23.39 | 46.99,23.39 44.45,23.39 44.33,23.52 | 44.2,23.65 44.07,23.77 44.07,27.58 43.69,27.96 42.67,27.96 42.04,28.6 | 41.91,28.73 41.91,31.52 42.67,31.52 43.27,32.12 44.45,32.12 | R6.2 32.17,31.86 32.39,31.65 | 32.51,31.52 41.66,31.52 | v62.74,21.36 62.2,20.82 U4.9P 60.85,22.26 61.18,22.6 LED13.C | 43.69,10.69 48.52,10.69 48.85,10.36 U4.2P | C12.2 45.91,46.15 C15.2 | C15.2 C13.2 | C5.1 37.09,46.25 | PROG.1 37.09,47.78 37.09,46.25 | IC1.5 62.41,27.53 v62.49,27.46 | C15.2 46.27,44.98 47.75,44.98 47.79,44.95 SW1.2 SW1.4 | C1.1 56.99,40.24 v57.41,40.66 | 43.69,10.69 43.69,14.5 v44.45,14.5 v44.45,18.31 44.45,20.34 44.93,20.82 U4.16P 46.85,23.25 46.99,23.39 | C11.2 27.18,14.5 | 27.18,14.5 v27.18,18.31 | U2.2 30.23,14.25 29.97,14.5 27.18,14.5 | C14.2 12.19,39.99 12.9,40.69 U$36.P$4 | C10.2 9.91,43.55 11.74,45.38 POWER.2 | C3.2 C8.1 | UFL.1 41.4,8.41 43.69,10.69
  Top 1.016: RAINGAUGE.3 6.61,35.33 7.88,34.06 14.73,34.06 15.09,34.41 | 15.09,34.41 U$36.P$4 | U$19.-OUT U$19.-OUT1 | U$19.-OUT1 23.62,21.87 U$20.P$5 | U$19.-OUT1 U$19.-IN1 U$19.-IN | C17.2 36.74,38.54 37.09,38.89 U$36.P$2 | C16.1 15.58,33.21 15.09,33.71 15.09,34.41 | X3.BASE@2 X3.BASE@1
  Bottom 0.254: v44.45,14.5 45.8,14.5 RTC-BATT.- | v62.49,27.46 61.98,27.96 60.96,27.96 59.95,28.98 v55.88,28.98 47.25,28.98 46.99,29.23 v46.99,31.01
  Bottom 0.406: X3.SPRT@4 53.55,48.54 | 53.55,48.54 53.55,46.16 X3.SPRT@2 | RST.1 59.69,45.1 X3.SPRT@1 60.75,46.16 X3.SPRT@3 53.67,48.66 53.55,48.54
  Bottom 0.508: U$20.P$8 65.03,22.12 64.26,21.36 | 64.26,21.36 v62.74,21.36 | 64.26,21.36 64.26,15.52 | U$20.P$11 65.28,14.5 64.26,15.52 | RTC-BATT.- 45.8,15.14 46.18,15.52 64.26,15.52 | v44.45,18.31 U$7.GND v27.18,18.31 21.59,12.72 U$19.-IN1 | v57.41,40.66 59.44,40.66 59.69,40.92 RST.1
  Bottom 1.016: RAINGAUGE.3 SOLAR.1 7.01,30.25 7.01,22.12 5.29,20.4 BATTERY.1 | TRIGGER.2 20.17,49.3 | 20.17,49.3 11.64,49.3 11.64,47.12 POWER.2 | PROG.1 35.56,49.3 20.17,49.3
  pour Top: 51.56,32.54 56.64,32.54 56.64,27.46 51.56,27.46 51.56,31.77
  pour Bottom (isolate 0.406, no thermals): 68.58,0.02 2.75,0.02 arc-90 0.21,2.56 0.21,48.54 arc-90 2.75,51.08 68.58,51.08 arc-90 71.22,48.44 71.22,2.67 arc-90
GSM_RST  (via drill 0.35)
  Top 0.254: SAMDG21.28 60.18,28.75 61.72,27.2 61.72,26.44 62.23,25.93 63.25,25.93 64.01,25.17 64.01,10.95 62.23,9.17 v58.42,9.17
  Bottom 0.254: v58.42,9.17 41.15,9.17 39.63,10.69 U$7.RST
INTPIN6
  Top 0.508: IC1.3 63.68,34.39 64.01,34.06 R4.1
LORA-CUT
  cutout Bottom: 45.72,20.7 61.98,20.7 61.98,4.65 45.97,4.65 arc45 45.72,4.55 45.72,20.46 arc-45 45.82,20.7
MISO
  Top 0.254: SAMDG21.21 55.35,24.68 55.88,24.15 58.17,24.15 58.85,23.47 U4.10P
MOSI
  Top 0.254: SAMDG21.19 54.35,24.66 53.85,24.15 53.85,19.84 54.36,19.33 56.64,19.33 56.9,19.58 56.9,20.78 U4.11P
N$1
  Top 0.254: SAMDG21.43 53.85,39.14 54.1,39.39 C1.2
N$2  (via drill 0.35)
  Top 0.508: v65.03,12.72 65.03,26.95 63.68,28.29 IC1.6
  Bottom 0.254: RTC-BATT.+ 62.5,12.72
  Bottom 0.508: v65.03,12.72 62.5,12.72
N$4
  Top 0.254: SAMDG21.6 45.87,30.25 L1.2
  Top 0.508: L1.2 44.22,30.39 C6.2
N$5
  Top 0.254: SAMDG21.2 48.3,32.25 47.5,33.04 47.5,34.82 47.25,35.08 C2.1
  Top 0.508: X2.P$1 46.16,35.17 C2.1
N$6
  Top 0.508: C17.1 24.13,41.43 20.32,41.43 20.13,41.24 | IC2.6 20.13,41.24 | TRIGGER.1 20.13,44.44 20.13,41.24
N$7
  Top 0.254: X2.P$2 43.69,37.43 43.69,38.89 43.94,39.14 48.01,39.14 48.01,33.25 48.51,32.75 SAMDG21.1
  Top 0.508: X2.P$2 42,37.36 C4.1
N$40
  Top 0.508: LED13.A 62.11,24.32 R7.2
RAIN_G  (via drill 0.35)
  Top 0.254: SAMDG21.10 48.04,28.25 v46.99,27.2 | C14.1 13.82,35.9 v13.82,35.89 | v31.4,30.76 31.6,30.56 38.05,30.56 v39.88,28.73
  Top 0.508: RAINGAUGE.2 4.15,37.53 C10.1 C14.1
  Bottom 0.254: v46.99,27.2 44.45,27.2 43.69,27.96 40.64,27.96 v39.88,28.73 | v13.82,35.89 13.82,33.45 15.39,31.88 30.28,31.88 v31.4,30.76
RX  (via drill 0.35)
  Top 0.254: SAMDG21.16 52.85,24.12 51.87,23.14 v51.56,23.14
  Bottom 0.508: U$20.P$7 65.53,24.66 64.77,25.42 61.47,25.42 59.18,23.14 v51.56,23.14
SCK
  Top 0.254: SAMDG21.20 U4.12P
SCL  (via drill 0.35)
  Top 0.254: 66.3,32.03 62.03,32.03 60.71,30.71 v60.71,30 59.96,30.75 SAMDG21.32 | 66.3,32.03 66.42,31.9 | R2.2 66.55,32.03 | 66.55,32.03 66.3,32.03 | IC1.8 66.22,31.7 66.42,31.9 | 66.42,31.9 66.55,32.03
SDA  (via drill 0.35)
  Top 0.254: SAMDG21.31 59.27,30.25 60.54,28.98 v61.22,28.98 | 65.28,28.47 68.07,28.47 68.14,28.54 R1.2 | 65.28,28.47 65.15,28.6 | 65.15,28.6 64.95,28.8 IC1.7 | 65.15,28.6 v65.03,28.47 65.28,28.47
  Bottom 0.254: v65.03,28.47 61.72,28.47 v61.22,28.98
SOLAR
  Top 1.016: SOLAR.2 14.07,27.71 U$36.P$3
SWCLK  (via drill 0.35)
  Top 0.254: v52.58,36.6 52.85,36.33 SAMDG21.45
  Bottom 0.254: v52.58,36.6 52.33,36.6 45.47,43.46 45.47,47.52 PROG.5
SWDIO  (via drill 0.35)
  Top 0.254: v51.06,36.85 52.35,35.56 SAMDG21.46
  Bottom 0.254: PROG.4 44.96,47.52 44.96,42.7 50.8,36.85 v51.06,36.85
TX  (via drill 0.35)
  Top 0.254: v51.56,24.15 51.99,24.15 52.35,24.52 SAMDG21.15
  Bottom 0.508: v51.56,24.15 58.68,24.15 60.96,26.44 64.52,26.44 65.28,27.2 U$20.P$6
USB_D+  (via drill 0.35)
  Top 0.254: SAMDG21.34 59.66,31.75 60.45,32.54 v60.45,35.58 | X3.D+ 57.15,44.98 56.9,44.73 56.39,44.73 55.12,43.46 RST.3
  Bottom 0.254: RST.3 55.63,42.44 55.63,38.63 58.68,35.58 v60.45,35.58
USB_D-  (via drill 0.35)
  Top 0.254: X3.D- 57.8,44.11 RST.2 | SAMDG21.33 59.93,31.25 61.22,32.54 v61.22,36.6
  Bottom 0.254: RST.2 56.14,42.44 56.14,38.89 58.42,36.6 v61.22,36.6
VBUS  (via drill 0.35)
  Top 0.254: X3.VBUS 58.45,44.95 58.68,44.73 61.98,44.73 62.49,44.22 v62.49,41.93
  Top 0.508: U2.1 29.28,10.79 R10.1 | R10.1 27.25,10.69 C11.1 v27.18,8.91 | R10.1 29.39,10.68 D1.C
  Bottom 0.254: 27.56,7.01 27.69,6.88 | 68.33,41.93 68.46,41.81
  Bottom 0.508: v62.49,41.93 68.33,41.93 | 68.46,41.81 69.6,40.66 69.6,12.47 68.84,11.71 66.8,11.71 61.98,6.88 27.69,6.88 | v27.18,8.91 27.18,7.39 27.56,7.01
VOLT_SENS  (via drill 0.35)
  Top 0.254: v49.79,36.6 50.93,35.46 51.69,35.46 51.85,35.29 SAMDG21.47 | v41.66,32.79 R6.1 R5.2
  Bottom 0.254: v49.79,36.6 43.69,36.6 42.67,35.58 42.67,33.3 42.17,32.79 v41.66,32.79
(copper drawn outside any net)
  shapes: Top area x2

### Text on the board
tNames: GND | 3V3 | RST | SWDIO | SWCLK | V5 Datalogger | GND | 12VIN | GND | TRIG | version 2.20 | HI-CD TP, MAD | 3V3 | D+ | D- | GND | GND | SIG | GND | GND | SOLAR | SOLAR-IN | BATT | BATT | GND | GND | GND | 4.0V | Champagne Datalogger | 06-08-2020 | RING | GND | VIN | ANT